# EAGLE design wheel-opto-sensor (EAGLE 7.5.0)
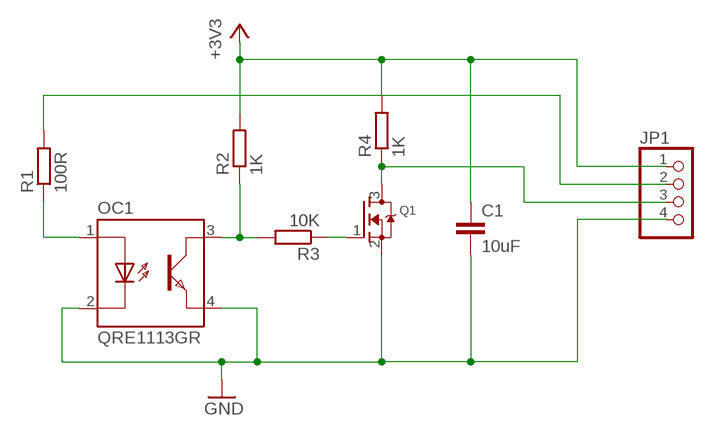
[diagram p0: schematic, sheet 1]

## Parts
C1  10uF  C-EUC1206  [C1206]
JP1  PINHD-1X4  [1X04]
OC1  QRE1113GR  [SMT_GULLWING_4]
Q1  MOSFET-NREFLOW  [SOT23]
R1  100R  R-EU_M0805  [M0805]
R2  1K  R-EU_M0805  [M0805]
R3  10K  R-EU_M0805  [M0805]
R4  1K  R-EU_M0805  [M0805]

## Nets
+3V3: C1.1 JP1.1 R2.2 R4.2
GND: C1.2 JP1.4 OC1.2(C) OC1.4(TE) Q1.2(S)
N$1: JP1.3 Q1.3(D) R4.1
N$2: OC1.1(A) R1.1
N$3: JP1.2 R1.2
N$4: Q1.1(G) R3.1
N$5: OC1.3(TC) R2.1 R3.2

## Library data of the parts
C1 = rcl:C-EU: CAPACITOR, European symbol
JP1 = pinhead:PINHD-1X4: PIN HEADER
OC1 = we-opto:QRE1113GR: Fairchild QRE1113GR Reflective Object Sensor
Q1 = adafruit:MOSFET-N: N-Channel Mosfet 2N7002E - 60V 260mA SOT23 [Digikey: 2N7002ET1GOSTR-ND] - REEL BSH103 - 30V 850mA SOT23 [Digikey: 568-5013-1-ND]
R1-R4 = rcl:R-EU_: RESISTOR, European symbol

## Board
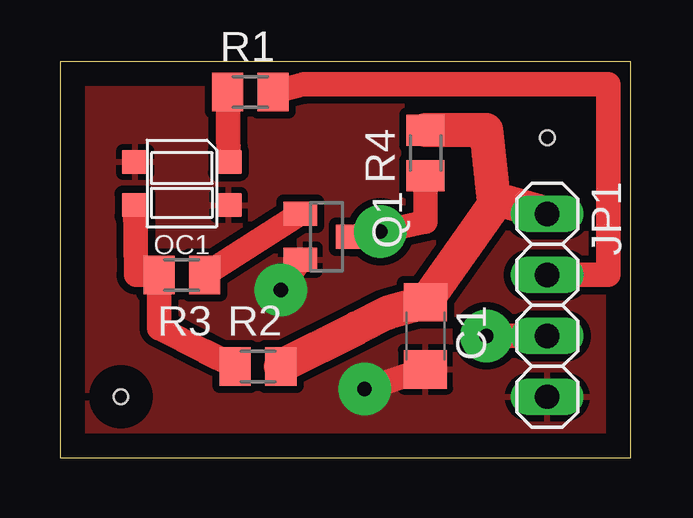
[diagram p1: board, top side]
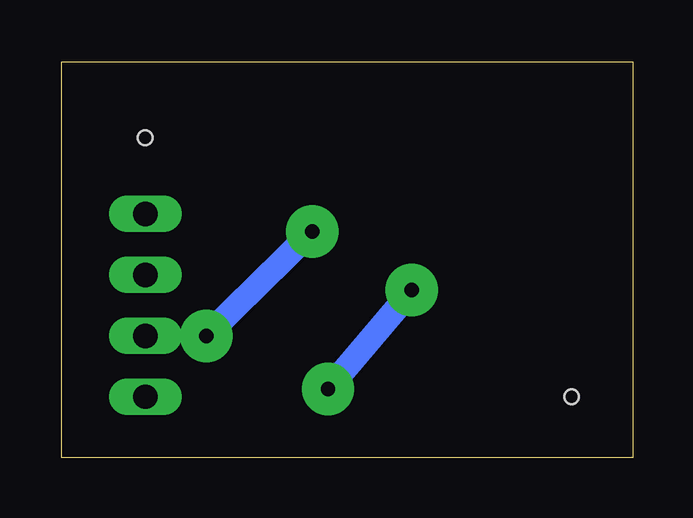
[diagram p2: board, bottom side, seen from below]

Size 23.8 x 16.5 mm. Coordinates in mm from the lower left corner, seen from the top.
Outline: 0,0 23.8,0 23.8,16.5 0,16.5 0,0
Copper layers (1*16): Top 0.035mm / dielectric 1.5mm / Bottom 0.035mm
Design rules "default *": minimum track width 10mil, minimum drill 24mil, track to track 12mil, track to pad 12mil, pad to pad 12mil, via to via 12mil, smd to smd 8mil, copper to edge 40mil, drill to drill 8mil, minimum pad ring 10mil, minimum via ring 8mil, stop-mask expansion 4mil, vias tented up to drill 0mil, thermal gap 10mil
Holes 0.6 mm at 2.54,2.54 20.32,13.34

### Footprints (pad centres in the part's own frame; a part is rotated, then mirrored left to right if it is on the bottom)
C1206 = smd 1.6 x 1.8: 1 -1.4,0; 2 1.4,0
1X04 = drill 1.016 long: 1 -3.81,0; 2 -1.27,0; 3 1.27,0; 4 3.81,0
SMT_GULLWING_4 = smd 1.1 x 1: 1 -1.95,-0.9; 2 1.95,-0.9; 3 1.95,0.9; 4 -1.95,0.9
SOT23 = smd 1 x 1.4: 1 -0.95,-1.1; 2 0.95,-1.1; 3 0,1.1
M0805 = smd 1.3 x 1.6: 1 -0.95,0; 2 0.95,0

### Placement (x,y rotation side)
C1  15.24,5.08 270 top
JP1  20.32,6.35 270 top
OC1  5.08,11.43 180 top
Q1  11.11,9.21 270 top
R1  7.94,15.24 0 top
R2  8.26,3.81 0 top
R3  5.08,7.62 180 top
R4  15.24,12.7 90 top

### Tracks (layer width: path | path; a pad name or v marks a point on that pad's centre or on a via)
+3V3
  Top 1.422: JP1.1 18.27,10.75 | 18.27,10.75 18.1,10.79 17.78,13.65 R4.2 | 18.27,10.75 C1.1 13.65,6.03 12.38,5.4 R2.2
GND  (via drill 0.6 pad 2.18)
  Top 1.016: Q1.2 v9.21,6.99 | v12.7,2.86 C1.2
  Bottom 1.016: v9.21,6.99 v12.7,2.86
  pour Top: 0,0 0,16.51 23.81,16.51 23.81,16.19 23.81,0
N$1  (via drill 0.6 pad 2.18)
  Top 1.016: Q1.3 13.05,9.36 v13.36,9.43 15.24,9.84 R4.1 | JP1.3 v17.78,5.08
  Bottom 1.016: v17.78,5.08 v13.36,9.43
N$2
  Top 1.016: OC1.1 R1.1
N$3
  Top 1.016: JP1.2 22.86,7.62 22.86,15.56 10.16,15.56 R1.2
N$4
  Top 1.016: Q1.1 R3.1
N$5
  Top 1.016: OC1.3 3.17,7.62 R3.2 4.13,5.4 6.03,4.45 R2.1